# EAGLE design LMT01-PCB (EAGLE 7.7.0)
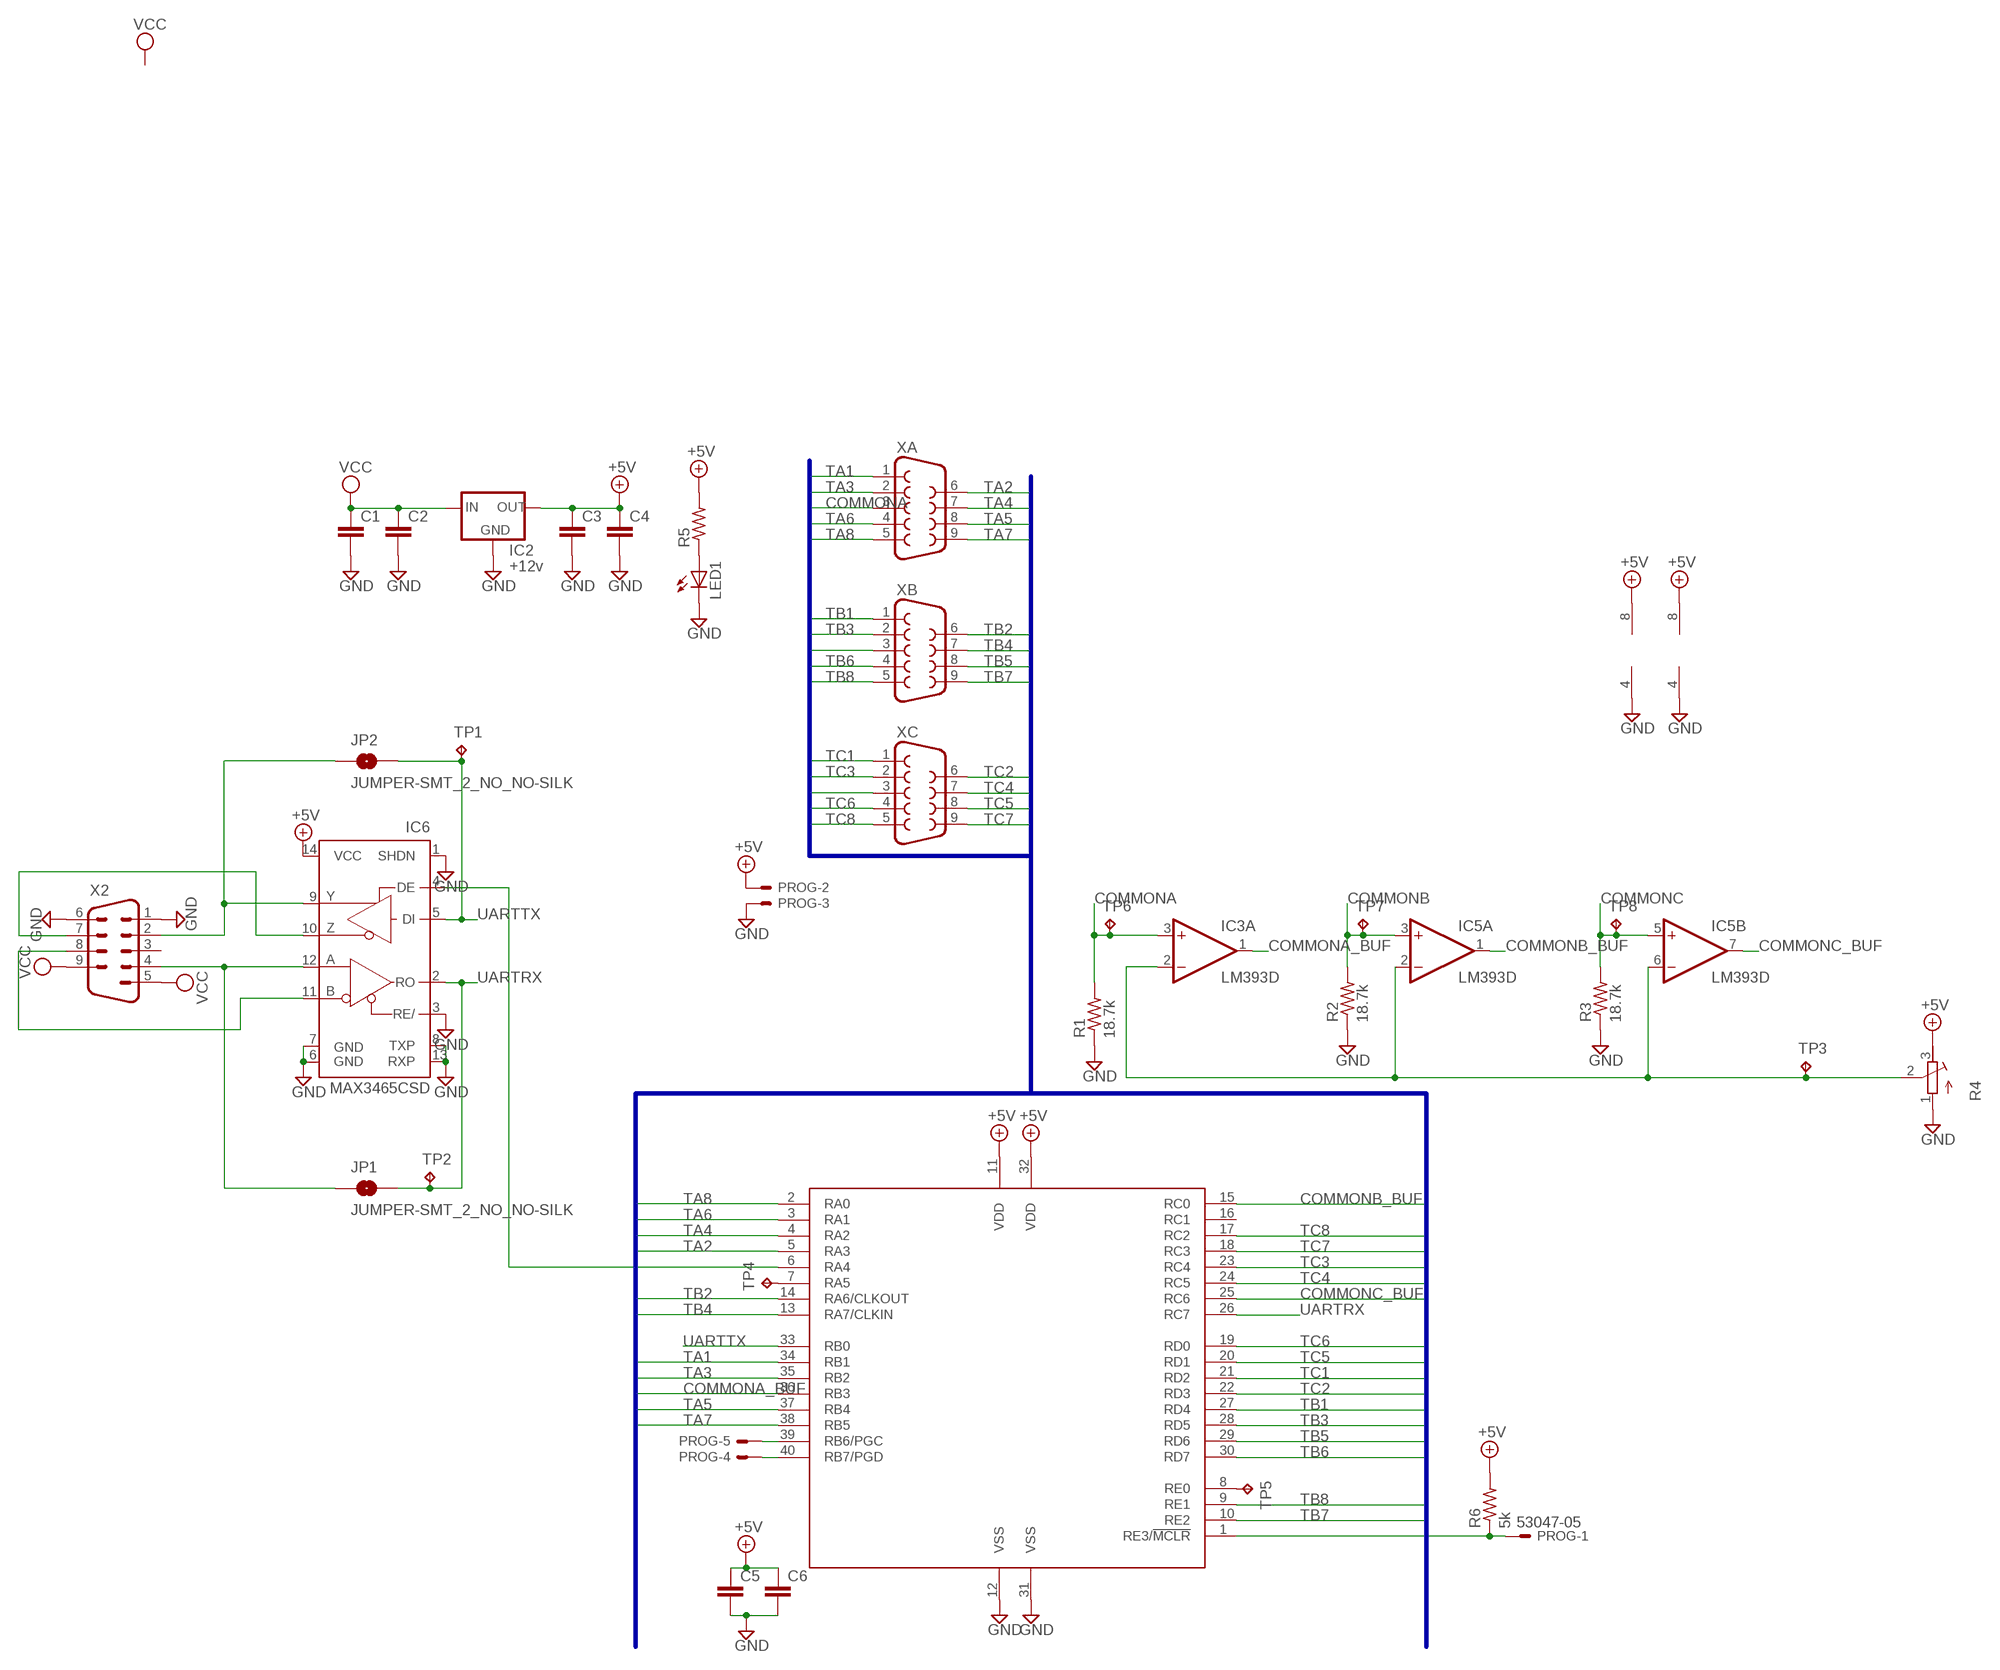
[diagram p0: schematic, sheet 1]

## Parts
C1  C-EUC1206  [C1206]
C2  C-EUC1206  [C1206]
C3  C-EUC1206  [C1206]
C4  C-EUC1206  [C1206]
C5  C-EUC1206  [C1206]
C6  C-EUC1206  [C1206]
IC1  PIC18F47Q84  [DIL40]
IC2  +12v  V_REG_78XX7812  [TO-252]
IC3  LM393D  [SO08]
IC5  LM393D  [SO08]
IC6  MAX3465CSD  [SO14]
JP1  JUMPER-SMT_2_NO_NO-SILK  [SMT-JUMPER_2_NO_NO-SILK]
JP2  JUMPER-SMT_2_NO_NO-SILK  [SMT-JUMPER_2_NO_NO-SILK]
LED1  LEDCHIPLED_1206  [CHIPLED_1206]
PROG  53047-05  [53047-05]
R1  18.7k  R-US_R1206  [R1206]
R2  18.7k  R-US_R1206  [R1206]
R3  18.7k  R-US_R1206  [R1206]
R4  R-TRIMM4G/J  [RTRIM4G/J]
R5  R-US_R1206  [R1206]
R6  5k  R-US_R1206  [R1206]
TP1  TPB1,27  [B1,27]
TP2  TPB1,27  [B1,27]
TP3  TPB1,27  [B1,27]
TP4  TPB1,27  [B1,27]
TP5  TPB1,27  [B1,27]
TP6  TPB1,27  [B1,27]
TP7  TPB1,27  [B1,27]
TP8  TPB1,27  [B1,27]
X2  M09HP  [M09HP]
XA  F09HP  [F09HP]
XB  F09HP  [F09HP]
XC  F09HP  [F09HP]

## Nets
+5V: C3.1 C4.1 C5.1 C6.1 IC1.11(VDD) IC1.32(VDD) IC2.2(OUT) IC3.8(P:V+) IC5.8(P:V+) IC6.14(VCC) PROG.2 R4.3(E) R5.2 R6.2
COMMONA: IC3.3(A:+IN) R1.2 TP6.TP XA.3
COMMONA_BUF: IC1.36(RB3) IC3.1(A:OUT)
COMMONB: IC5.3(A:+IN) R2.2 TP7.TP XB.3
COMMONB_BUF: IC1.15(RC0) IC5.1(A:OUT)
COMMONC: IC5.5(B:+IN) R3.2 TP8.TP XC.3
COMMONC_BUF: IC1.25(RC6) IC5.7(B:OUT)
GND: C1.2 C2.2 C3.2 C4.2 C5.2 C6.2 IC1.12(VSS) IC1.31(VSS) IC2.3(GND) IC3.4(P:V-) IC5.4(P:V-) IC6.1(SHDN) IC6.3(RE/) IC6.6(GND) IC6.7(GND) IC6.8(TXP) IC6.13(RXP) LED1.C PROG.3 R1.1 R2.1 R3.1 R4.1(A) X2.1 X2.6
N$1: IC1.1(RE3/!MCLR) PROG.1 R6.1
N$2: IC1.40(RB7/PGD) PROG.4
N$3: IC1.39(RB6/PGC) PROG.5
N$4: IC3.2(A:-IN) IC5.2(A:-IN) IC5.6(B:-IN) R4.2(S) TP3.TP
N$5: LED1.A R5.1
N$6: IC1.7(RA5) TP4.TP
N$7: IC1.8(RE0) TP5.TP
N$9: IC1.6(RA4) IC6.4(DE)
RX+: IC6.12(A) JP1.1 X2.4
RX-: IC6.11(B) X2.8
TA1: IC1.34(RB1) XA.1
TA2: IC1.5(RA3) XA.6
TA3: IC1.35(RB2) XA.2
TA4: IC1.4(RA2) XA.7
TA5: IC1.37(RB4) XA.8
TA6: IC1.3(RA1) XA.4
TA7: IC1.38(RB5) XA.9
TA8: IC1.2(RA0) XA.5
TB1: IC1.27(RD4) XB.1
TB2: IC1.14(RA6/CLKOUT) XB.6
TB3: IC1.28(RD5) XB.2
TB4: IC1.13(RA7/CLKIN) XB.7
TB5: IC1.29(RD6) XB.8
TB6: IC1.30(RD7) XB.4
TB7: IC1.10(RE2) XB.9
TB8: IC1.9(RE1) XB.5
TC1: IC1.21(RD2) XC.1
TC2: IC1.22(RD3) XC.6
TC3: IC1.23(RC4) XC.2
TC4: IC1.24(RC5) XC.7
TC5: IC1.20(RD1) XC.8
TC6: IC1.19(RD0) XC.4
TC7: IC1.18(RC3) XC.9
TC8: IC1.17(RC2) XC.5
TX+: IC6.9(Y) JP2.1 X2.2
TX-: IC6.10(Z) X2.7
UARTRX: IC1.26(RC7) IC6.2(RO) JP1.2 TP2.TP
UARTTX: IC1.33(RB0) IC6.5(DI) JP2.2 TP1.TP
VCC: C1.1 C2.1 IC2.1(IN) X2.5 X2.9
Unconnected: IC1.16(RC1) IC3.5(B:+IN) IC3.6(B:-IN) IC3.7(B:OUT) X2.3

## Buses
TA1,TA2,TA3,TA4,TA5,TA6,TA7,TA8,TB1,TB2,TB3,TB4,TB5,TB6,TB7,TB8,TC1,TC2,TC3,TC4,TC5,TC6,TC7,TC8,COMMONA,COMMONB,COMMONC

## Library data of the parts
C1-C6 = resistor:C-EU: CAPACITOR, European symbol
IC1 = FRC696:PIC18F47Q84
IC2 = SparkFun-IC-Power:V_REG_78XX: Voltage Regulator Standard 78xx regulator. IGO (Input Ground Output). Spark Fun Electronics SKU : COM-00107; PROD_ID: VREG-12370
IC3 IC5 = linear:LM393: COMPARATOR
IC6 = maxim:MAX346*: +5V, Fail-Safe, 40Mbps, Profibus RS-485/RS-422 Transceivers Source: MAX3465-MAX3469.pdf; MPN: MAX3465CSD+; OC_FARNELL: unknown; OC_NEWARK: 65K6814
JP1 JP2 = SparkFun-Jumpers:JUMPER-SMT_2_NO: Normally open jumper This jumper has two pads in close proximity to each other. Apply solder to close the connection. Round pads are easier to solder for beginners, but are a lot larger. SparkFun Product that uses the round pads: SparkFun EL Sequencer <https://www.sparkfun.com/products/12781>
LED1 = led:LED: LED OSRAM: - CHIPLED LG R971, LG N971, LY N971, LG Q971, LY Q971, LO R971, LY R971 LH N974, LH R974 LS Q976, LO Q976, LY Q976 LO Q996 - Hyper CHIPLED LW Q18S LB Q993, LB Q99A, LB R99A - SideLED LS A670, LO A670, LY A670, LG A670, LP A670 LB A673, LV A673, LT A673, LW A673 LH A674 LY A675 LS A676, LA A676, LO A676, LY A676, LW A676 LS A679, LY A679, LG A679 - Hyper Micro SIDELED® LS Y876, LA Y876, LO Y876, LY Y876 LT Y87S - SmartLED LW L88C, LW L88S LB L89C, LB L89S, LG L890 LS L89K, LO L89K, LY L89K LS L896, LA L896, LO L896, LY L896 - TOPLED LS T670, LO T670, LY T670, LG T670, LP T670 LSG T670, LSP T670, LSY T670, LOP T670, LYG T670 LG T671, LOG T671, LSG T671 LB T673, LV T673, LT T673, LW T673 LH T674 LS T676, LA T676, LO T676, LY T676, LB T676, LH T676, LSB T676, LW T676 LB T67C, LV T67C, LT T67C, LS T67K, LO T67K, LY T67K, LW E67C LS E67B, LA E67B, LO E67B, LY E67B, LB E67C, LV E67C, LT E67C LW T67C LS T679, LY T679, LG T679 LS T770, LO T770, LY T770, LG T770, LP T770 LB T773, LV T773, LT T773, LW T773 LH T774 LS E675, LA E675, LY E675, LS T675 LS T776, LA T776, LO T776, LY T776, LB T776 LHGB T686 LT T68C, LB T68C - Hyper Mini TOPLED® LB M676 - Mini TOPLED Santana® LG M470 LS M47K, LO M47K, LY M47K Source: http://www.osram.convergy.de LUXEON: - LUMILED® LXK2-PW12-R00, LXK2-PW12-S00, LXK2-PW14-U00, LXK2-PW14-V00 LXK2-PM12-R00, LXK2-PM12-S00, LXK2-PM14-U00 LXK2-PE12-Q00, LXK2-PE12-R00, LXK2-PE12-S00, LXK2-PE14-T00, LXK2-PE14-U00 LXK2-PB12-K00, LXK2-PB12-L00, LXK2-PB12-M00, LXK2-PB14-N00, LXK2-PB14-P00, LXK2-PB14-Q00 LXK2-PR12-L00, LXK2-PR12-M00, LXK2-PR14-Q00, LXK2-PR14-R00 LXK2-PD12-Q00, LXK2-PD12-R00, LXK2-PD12-S00 LXK2-PH12-R00, LXK2-PH12-S00 LXK2-PL12-P00, LXK2-PL12-Q00, LXK2-PL12-R00 Source: www.luxeon.com KINGBRIGHT: KA-3528ASYC Source: www.kingbright.com
PROG = con-molex:53?-05: CONNECTOR wire to board 1.25 mm (.049 inch) pitch header; MF: MOLEX; MPN: 53047-0510; OC_FARNELL: 9732861; OC_NEWARK: 38C9901
R1-R3 R5 R6 = resistor:R-US_: RESISTOR, American symbol
R4 = resistor:R-TRIMM: Trimm resistor
TP1-TP8 = testpad:TP: Test pad
X2 = con-subd:M09: SUB-D; OC_FARNELL: unknown; OC_NEWARK: unknown
XA XB XC = con-subd:F09: SUB-D; OC_FARNELL: unknown; OC_NEWARK: unknown

## Board
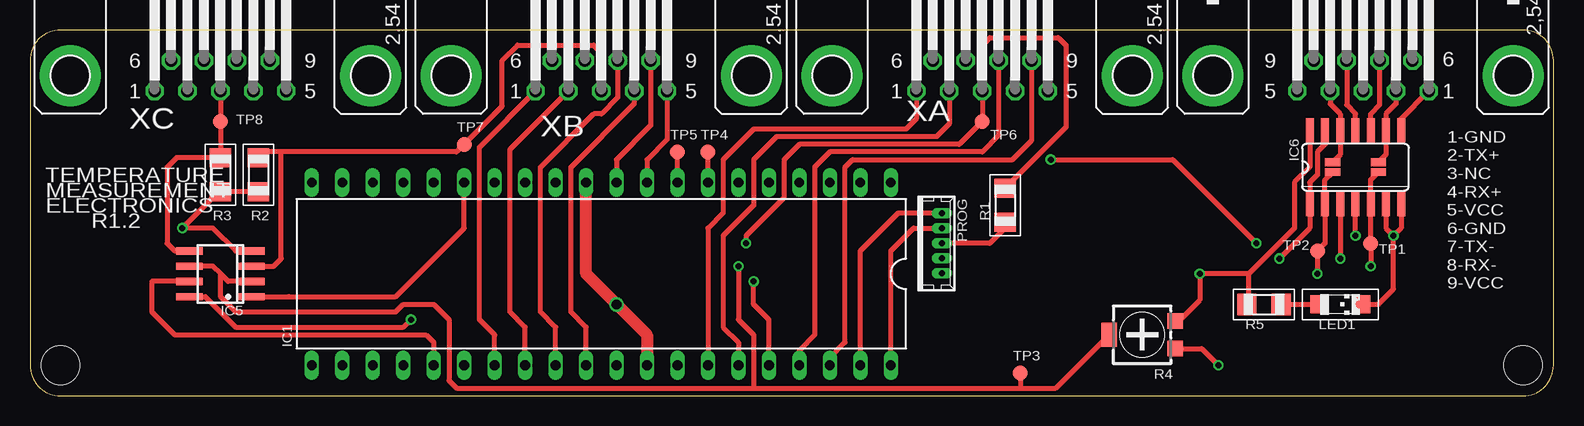
[diagram p1: board, top side]
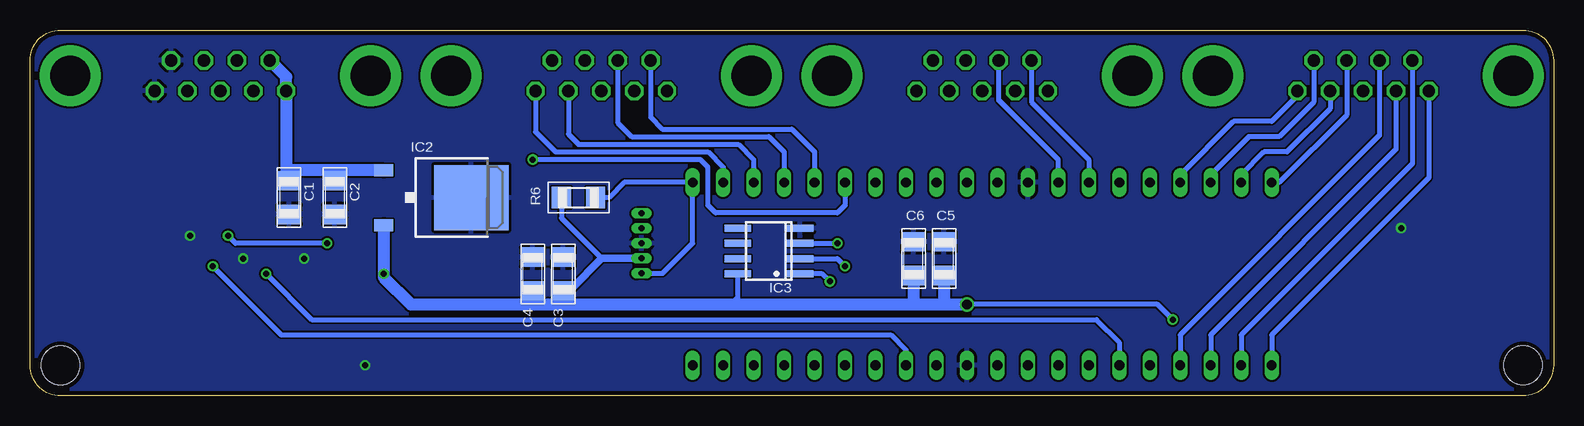
[diagram p2: board, bottom side, seen from below]

Size 127 x 30.48 mm. Coordinates in mm from the lower left corner, seen from the top.
Outline: 0,27.94 0,2.54 arc90 2.54,0 124.46,0 arc90 127,2.54 127,27.94 arc90 124.46,30.48 2.54,30.48 arc90 0,27.94
Copper layers (1*16): Top 0.0356mm / dielectric 1.5011mm / Bottom 0.0356mm
Design rules "Oshpark": minimum track width 6mil, minimum drill 13mil, track to track 6mil, track to pad 6mil, pad to pad 6mil, via to via 6mil, smd to smd 6mil, copper to edge 15mil, drill to drill 6mil, minimum pad ring 7mil, minimum via ring 7mil, stop-mask expansion 3mil, vias tented up to drill 0mil, thermal gap 10mil
Holes 3.2 mm at 2.54,2.54 124.46,2.54

### Footprints (pad centres in the part's own frame; a part is rotated, then mirrored left to right if it is on the bottom)
C1206 = smd 1.6 x 1.8: 1 -1.4,0; 2 1.4,0
DIL40 = drill 0.813 long: 1 -24.13,-7.62; 2 -21.59,-7.62; 3 -19.05,-7.62; 4 -16.51,-7.62; 5 -13.97,-7.62; 6 -11.43,-7.62; 7 -8.89,-7.62; 8 -6.35,-7.62; 9 -3.81,-7.62; 10 -1.27,-7.62; 11 1.27,-7.62; 12 3.81,-7.62; 13 6.35,-7.62; 14 8.89,-7.62; 15 11.43,-7.62; 16 13.97,-7.62; 17 16.51,-7.62; 18 19.05,-7.62; 19 21.59,-7.62; 20 24.13,-7.62; 21 24.13,7.62; 22 21.59,7.62; 23 19.05,7.62; 24 16.51,7.62; 25 13.97,7.62; 26 11.43,7.62; 27 8.89,7.62; 28 6.35,7.62; 29 3.81,7.62; 30 1.27,7.62; 31 -1.27,7.62; 32 -3.81,7.62; 33 -6.35,7.62; 34 -8.89,7.62; 35 -11.43,7.62; 36 -13.97,7.62; 37 -16.51,7.62; 38 -19.05,7.62; 39 -21.59,7.62; 40 -24.13,7.62
TO-252 = smd 1 x 1.6: 1 -2.28,-4.8; 2 2.28,-4.8 | smd 5.4 x 6.2: 3 0,2.5
SO08 = smd 0.6 x 2.2: 1 -1.905,-2.6; 2 -0.635,-2.6; 3 0.635,-2.6; 4 1.905,-2.6; 5 1.905,2.6; 6 0.635,2.6; 7 -0.635,2.6; 8 -1.905,2.6
SO14 = smd 0.66 x 2.032: 1 -3.81,-3.073; 2 -2.54,-3.073; 3 -1.27,-3.073; 4 0,-3.073; 5 1.27,-3.073; 6 2.54,-3.073; 7 3.81,-3.073; 8 3.81,3.073; 9 2.54,3.073; 10 1.27,3.073; 11 0,3.073; 12 -1.27,3.073; 13 -2.54,3.073; 14 -3.81,3.073
SMT-JUMPER_2_NO_NO-SILK = smd 0.635 x 1.27: 1 -0.406,0; 2 0.406,0
CHIPLED_1206 = smd 1.5 x 1.5: A 0,-1.75; C 0,1.75
53047-05 = drill 0.5 pad 0.698 long: 1 2.5,0.45; 2 1.25,0.45; 3 0,0.45; 4 -1.25,0.45; 5 -2.5,0.45
R1206 = smd 1.6 x 1.803: 1 -1.422,0; 2 1.422,0
RTRIM4G/J = smd 1.3 x 1.3: 1 -1.15,-2.75; 3 1.15,-2.75 | smd 2 x 1.3: 2 0,2.75
B1,27 = smd 1.27 x 1.27: TP 0,0
M09HP = drill 1.016 octagon: 1 -5.486,1.27; 2 -2.743,1.27; 3 0,1.27; 4 2.743,1.27; 5 5.486,1.27; 6 -4.115,-1.27; 7 -1.372,-1.27; 8 1.372,-1.27; 9 4.115,-1.27 | drill 3.302 pad 5.08: G1 -12.522,0; G2 12.522,0
F09HP = drill 1.016 octagon: 1 -5.486,-1.27; 2 -2.743,-1.27; 3 0,-1.27; 4 2.743,-1.27; 5 5.486,-1.27; 6 -4.115,1.27; 7 -1.372,1.27; 8 1.372,1.27; 9 4.115,1.27 | drill 3.302 pad 5.08: G1 -12.522,0; G2 12.522,0

### Placement (x,y rotation side)
C1  105.41,16.51 270 bottom
C2  101.6,16.51 270 bottom
C3  82.55,10.16 90 bottom
C4  85.09,10.16 90 bottom
C5  50.8,11.43 90 bottom
C6  53.34,11.43 90 bottom
IC1  47.62,10.16 180 top
IC2  92.71,16.51 270 bottom
IC3  65.41,12.06 90 bottom
IC5  15.88,10.16 90 top
IC6  110.49,19.05 0 top
JP1  108.58,19.05 270 top
JP2  112.39,19.05 270 top
LED1  109.22,7.62 270 top
PROG  75.56,12.7 270 top
R1  81.28,15.88 90 top
R2  19.05,18.41 90 top
R3  15.88,18.41 90 top
R4  92.71,5.08 90 top
R5  102.87,7.62 180 top
R6  81.28,16.51 180 bottom
TP1  111.76,12.7 0 top
TP2  107.31,12.06 0 top
TP3  82.55,1.91 0 top
TP4  56.52,20.32 0 top
TP5  53.98,20.32 0 top
TP6  79.38,22.86 0 top
TP7  36.2,20.95 0 top
TP8  15.88,22.86 0 top
X2  111.12,26.67 180 top
XA  79.38,26.67 0 top
XB  47.62,26.67 0 top
XC  15.88,26.67 0 top

### Tracks (layer width: path | path; a pad name or v marks a point on that pad's centre or on a via)
+5V  (via drill 0.5, 0.8)
  Top 0.406: 101.6,10.16 v97.51,10.16 97.51,7.97 95.77,6.23 R4.3 | IC5.8 14.61,8.26 17.14,5.71 31.11,5.71 v31.75,6.35 | R5.2 101.6,7.62 101.6,10.16 | IC6.14 106.68,19.05 105.41,17.78 105.41,13.97 101.6,10.16
  Top 1.016: IC1.11 46.35,10.16 v48.9,7.62 51.44,5.08 IC1.32
  Bottom 0.406: IC3.8 68,8.2 68.58,7.62 | v31.75,6.35 33.02,7.62 v48.9,7.62 | R6.2 82.7,14.8 79.36,11.45
  Bottom 0.61: PROG.2 79.36,11.45 81.92,8.89 82.42,8.89 C3.1
  Bottom 1.016: IC2.2 v97.51,10.16 97.51,9.88 95.25,7.62 85.09,7.62 | 85.09,7.62 82.55,7.62 | 82.55,7.62 68.58,7.62 53.34,7.62 | 53.34,7.62 50.8,7.62 | 50.8,7.62 v48.9,7.62 | C3.1 82.55,7.62 | C4.1 85.09,7.62 | C5.1 50.8,7.62 | C6.1 53.34,7.62
COMMONA  (via drill 0.5)
  Top 0.406: R1.2 86.36,22.38 86.36,29.21 85.72,29.84 80.01,29.84 79.38,29.21 XA.3 TP6.TP 77.47,20.95 64.14,20.95 62.87,19.68 62.87,16.51 59.69,13.34 v59.69,12.7
  Bottom 0.406: IC3.3 v59.69,12.7
COMMONA_BUF  (via drill 0.5)
  Top 0.406: IC1.36 61.59,6.35 60.33,7.62 v60.33,9.53
  Bottom 0.406: v60.33,9.53 60.96,10.16 IC3.1
COMMONB
  Top 0.406: XB.3 47.62,28.57 46.99,29.21 40.64,29.21 39.37,27.94 39.37,24.13 TP7.TP 35.56,20.32 20.95,20.32 | 20.95,20.32 19.53,20.32 R2.2 | IC5.3 20.32,10.79 20.95,11.43 20.95,20.32
COMMONB_BUF
  Top 0.406: IC5.1 21.59,8.26 30.48,8.26 36.2,13.97 IC1.15
COMMONC
  Top 0.406: IC5.5 12.06,12.06 11.43,12.7 11.43,19.05 12.22,19.84 R3.2 TP8.TP XC.3
COMMONC_BUF
  Top 0.406: IC1.25 33.66,4.45 33.02,5.08 12.06,5.08 10.16,6.99 10.16,9.53 IC5.7
GND  (via drill 0.5)
  Top 0.406: R1.1 81.28,13.97 80.01,12.7 PROG.3 | IC5.4 17.14,12.06 15.24,13.97 v12.7,13.97 15.72,16.99 R3.1 R2.1 | R4.1 97.67,3.93 v99.06,2.54 | LED1.C 112.39,7.62 113.67,8.89 v113.67,13.34 | IC6.7 114.3,13.97 v113.67,13.34 | IC6.6 113.03,13.97 v113.67,13.34 | v104.14,11.43 106.68,13.97 IC6.1 106.68,17.78 107.31,18.41 107.31,20.32 107.95,20.95 IC6.13 | IC6.3 v109.22,11.43 | IC6.8 114.3,23.09 X2.1
  pour Bottom: -15.24,58.42 142.24,58.42 142.24,-19.05 -15.24,-19.05
N$1
  Bottom 0.406: PROG.1 74.25,10.2 71.75,12.7 IC1.1 77.47,17.78 78.74,16.51 R6.1
N$2
  Top 0.406: IC1.40 71.75,12.06 73.66,13.97 76,13.97 PROG.4
N$3
  Top 0.406: IC1.39 69.22,12.06 72.39,15.24 75.97,15.24 PROG.5
N$4  (via drill 0.5)
  Top 0.406: IC5.2 16.51,9.53 15.88,10.16 | 15.88,10.16 15.24,10.79 IC5.6 | 60.33,0.64 82.55,0.64 | 82.55,0.64 85.52,0.64 R4.2 | v59.05,10.79 59.05,6.35 60.33,5.08 60.33,0.64 | 15.88,10.16 15.88,8.26 17.14,6.99 30.48,6.99 31.11,7.62 33.66,7.62 34.92,6.35 34.92,1.27 35.56,0.64 60.33,0.64 | TP3.TP 82.55,0.64
  Bottom 0.406: IC3.2 59.69,11.43 v59.05,10.79
N$5
  Top 0.406: R5.1 LED1.A
N$6
  Top 0.406: IC1.7 TP4.TP
N$7
  Top 0.406: IC1.8 TP5.TP
N$9  (via drill 0.5)
  Top 0.406: v110.49,13.34 IC6.4 | v85.09,19.68 95.25,19.68 v102.23,12.7
  Bottom 0.406: IC1.6 59.05,15.88 59.69,15.24 69.85,15.24 70.48,15.88 70.48,19.05 71.12,19.68 v85.09,19.68 | v102.23,12.7 109.86,12.7 v110.49,13.34
RX+
  Top 0.406: X2.4 108.38,24.33 109.22,23.5 IC6.12 109.22,20.09 JP1.1
RX-
  Top 0.406: X2.8 109.75,24.23 110.49,23.5 IC6.11
TA1
  Top 0.406: XA.1 73.89,23.09 73.03,22.23 60.33,22.23 57.78,19.68 57.78,15.24 56.52,13.97 IC1.34
TA2
  Bottom 0.406: XA.6 75.26,23.19 74.3,22.23 63.5,22.23 61.59,20.32 IC1.5
TA3
  Top 0.406: XA.2 76.63,22.66 75.56,21.59 62.23,21.59 60.33,19.68 60.33,15.88 57.78,13.34 57.78,5.71 59.05,4.45 IC1.35
TA4
  Bottom 0.406: XA.7 78,22.76 76.83,21.59 65.41,21.59 64.14,20.32 IC1.4
TA5
  Top 0.406: XA.8 80.75,21.69 79.38,20.32 66.67,20.32 65.41,19.05 65.41,5.08 64.14,3.81 IC1.37
TA6
  Bottom 0.406: XA.4 82.12,21.79 81.28,20.95 67.94,20.95 66.67,19.68 IC1.3
TA7
  Top 0.406: XA.9 83.49,21.26 81.92,19.68 68.58,19.68 67.94,19.05 67.94,4.45 66.67,3.17 IC1.38
TA8
  Bottom 0.406: XA.5 84.86,22 83.19,20.32 70.48,20.32 69.22,19.05 IC1.2
TB1
  Top 0.406: IC1.27 38.73,5.08 37.47,6.35 37.47,20.73 XB.1
TB2
  Bottom 0.406: XB.6 43.51,24.46 38.73,19.68 IC1.14
TB3
  Top 0.406: IC1.28 41.27,5.71 40.01,6.99 40.01,20.52 XB.2
TB4
  Bottom 0.406: IC1.13 41.27,19.68 46.25,24.66 XB.7
TB5
  Top 0.406: IC1.29 43.81,5.71 42.55,6.99 42.55,19.05 46.99,23.5 47.62,23.5 49,24.87 XB.8
TB6
  Top 0.406: IC1.30 46.35,5.71 45.09,6.99 45.09,19.05 50.37,24.33 XB.4
TB7
  Top 0.406: XB.9 51.74,22.53 48.9,19.68 IC1.10
TB8
  Top 0.406: XB.5 53.11,21.36 51.44,19.68 IC1.9
TC1
  Bottom 0.406: XC.1 10.39,18.19 23.5,5.08 IC1.21
TC2
  Bottom 0.406: XC.6 11.76,19.36 26.04,5.08 IC1.22
TC3
  Bottom 0.406: XC.2 13.13,20.52 28.57,5.08 IC1.23
TC4
  Bottom 0.406: XC.7 14.5,21.69 31.11,5.08 IC1.24
TC5
  Bottom 0.406: XC.8 17.25,23.39 22.86,17.78 IC1.20
TC6
  Bottom 0.406: XC.4 18.62,23.93 22.23,20.32 24.13,20.32 26.04,18.41 IC1.19
TC7
  Bottom 0.406: XC.9 19.99,24.46 22.86,21.59 25.4,21.59 28.57,18.41 IC1.18
TC8
  Bottom 0.406: XC.5 21.36,24.99 23.5,22.86 26.67,22.86 31.11,18.41 IC1.17
TX+
  Top 0.406: X2.2 113.87,24.33 113.03,23.5 IC6.9 113.03,20.09 JP2.1
TX-
  Top 0.406: X2.7 112.5,24.23 111.76,23.5 IC6.10
UARTRX  (via drill 0.5)
  Top 0.406: v107.31,10.16 TP2.TP 107.95,12.7 IC6.2 107.95,18.01 JP1.2
  Bottom 0.406: v107.31,10.16 103.5,6.35 38.1,6.35 36.2,4.45 IC1.26
UARTTX  (via drill 0.5)
  Top 0.406: v111.76,10.79 TP1.TP IC6.5 111.76,18.01 JP2.2
  Bottom 0.406: v111.76,10.79 106.05,5.08 55.24,5.08 53.98,3.81 IC1.33
VCC
  Bottom 1.016: X2.9 105.64,26.57 X2.5 105.64,19.05 | 105.64,19.05 105.64,18.14 C1.1 | IC2.1 101.6,18.79 | 101.6,18.79 105.38,18.79 105.64,19.05 | C2.1 101.6,18.79

### Text on the board
tPlace: TEMPERATURE | MEASUREMENT | ELECTRONICS | R1.2 | 1-GND / 2-TX+ / 3-NC / 4-RX+ / 5-VCC / 6-GND / 7-TX- / 8-RX- / 9-VCC